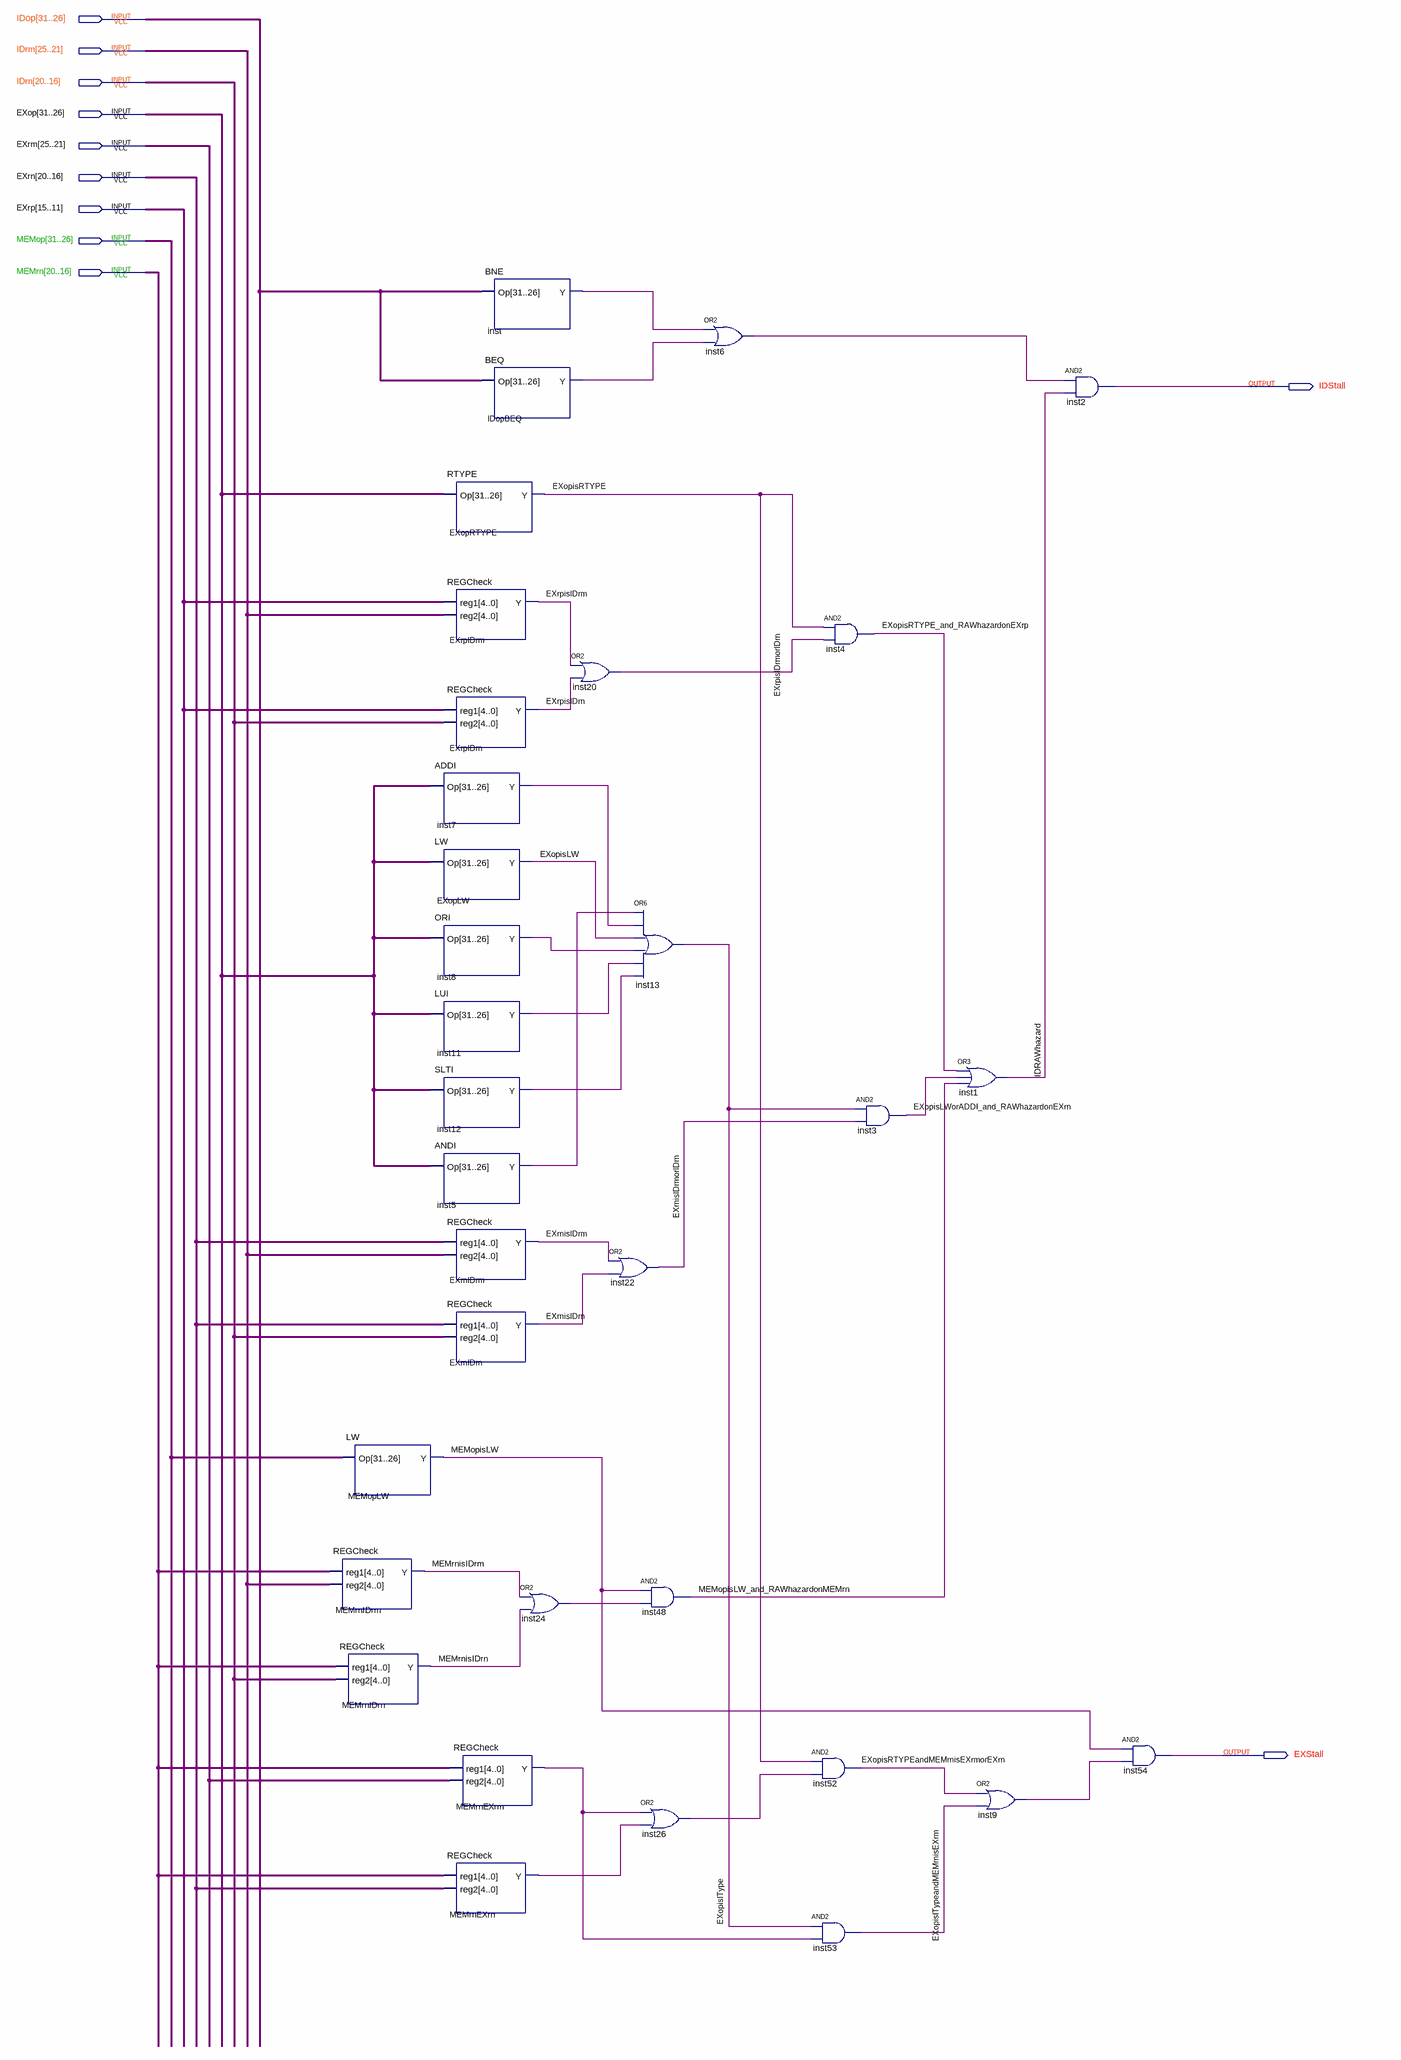
[diagram p0: schematic sheet]
// Quartus schematic StallDetection.bdf as structural Verilog: 33 symbols, 11 pins
module StallDetection (
  input  [31:26] IDop,
  input  [25:21] IDrm,
  input  [20:16] IDrn,
  input  [31:26] EXop,
  input  [25:21] EXrm,
  input  [20:16] EXrn,
  input  [15:11] EXrp,
  input  [31:26] MEMop,
  input  [20:16] MEMrn,
  output IDStall,
  output EXStall
);

  wire EXopisIType, EXopisITypeandMEMrnisEXrm, EXopisLW, EXopisLWorADDI_and_RAWhazardonEXrn, EXopisRTYPE,
       EXopisRTYPE_and_RAWhazardonEXrp, EXopisRTYPEandMEMrnisEXrmorEXrn, EXrnisIDrm, EXrnisIDrmorIDrn,
       EXrnisIDrn, EXrpisIDrm, EXrpisIDrmorIDrn, EXrpisIDrn, IDopBEQ_y, IDRAWhazard, inst5_y, inst6_out,
       inst7_y, inst8_y, inst9_out, inst11_y, inst12_y, inst24_out, inst26_out, inst_y, MEMopisLW,
       MEMopisLW_and_RAWhazardonMEMrn, MEMrnEXrm_y, MEMrnEXrn_y, MEMrnisIDrm, MEMrnisIDrn;

  LW MEMopLW (.Op(MEMop), .Y(MEMopisLW));
  REGCheck MEMrnIDrm (.reg1(MEMrn), .reg2(IDrm), .Y(MEMrnisIDrm));
  REGCheck MEMrnIDrn (.reg1(MEMrn), .reg2(IDrn), .Y(MEMrnisIDrn));
  RTYPE EXopRTYPE (.Op(EXop), .Y(EXopisRTYPE));
  REGCheck EXrpIDrm (.reg1(EXrp), .reg2(IDrm), .Y(EXrpisIDrm));
  REGCheck EXrpIDrn (.reg1(EXrp), .reg2(IDrn), .Y(EXrpisIDrn));
  ADDI inst7 (.Op(EXop), .Y(inst7_y));
  LW EXopLW (.Op(EXop), .Y(EXopisLW));
  ORI inst8 (.Op(EXop), .Y(inst8_y));
  LUI inst11 (.Op(EXop), .Y(inst11_y));
  SLTI inst12 (.Op(EXop), .Y(inst12_y));
  ANDI inst5 (.Op(EXop), .Y(inst5_y));
  REGCheck EXrnIDrm (.reg1(EXrn), .reg2(IDrm), .Y(EXrnisIDrm));
  REGCheck EXrnIDrn (.reg1(EXrn), .reg2(IDrn), .Y(EXrnisIDrn));
  REGCheck MEMrnEXrn (.reg1(MEMrn), .reg2(EXrn), .Y(MEMrnEXrn_y));
  BNE inst (.Op(IDop), .Y(inst_y));
  BEQ IDopBEQ (.Op(IDop), .Y(IDopBEQ_y));
  REGCheck MEMrnEXrm (.reg1(MEMrn), .reg2(EXrm), .Y(MEMrnEXrm_y));
  or inst24 (inst24_out, MEMrnisIDrm, MEMrnisIDrn);
  or inst20 (EXrpisIDrmorIDrn, EXrpisIDrm, EXrpisIDrn);
  or inst13 (EXopisIType, inst5_y, inst7_y, EXopisLW, inst8_y, inst11_y, inst12_y);
  or inst22 (EXrnisIDrmorIDrn, EXrnisIDrm, EXrnisIDrn);
  and inst48 (MEMopisLW_and_RAWhazardonMEMrn, MEMopisLW, inst24_out);
  or inst26 (inst26_out, MEMrnEXrm_y, MEMrnEXrn_y);
  or inst6 (inst6_out, inst_y, IDopBEQ_y);
  and inst4 (EXopisRTYPE_and_RAWhazardonEXrp, EXopisRTYPE, EXrpisIDrmorIDrn);
  and inst52 (EXopisRTYPEandMEMrnisEXrmorEXrn, EXopisRTYPE, inst26_out);
  and inst53 (EXopisITypeandMEMrnisEXrm, EXopisIType, MEMrnEXrm_y);
  and inst3 (EXopisLWorADDI_and_RAWhazardonEXrn, EXopisIType, EXrnisIDrmorIDrn);
  or inst1 (IDRAWhazard, EXopisRTYPE_and_RAWhazardonEXrp, EXopisLWorADDI_and_RAWhazardonEXrn, MEMopisLW_and_RAWhazardonMEMrn);
  or inst9 (inst9_out, EXopisRTYPEandMEMrnisEXrmorEXrn, EXopisITypeandMEMrnisEXrm);
  and inst2 (IDStall, inst6_out, IDRAWhazard);
  and inst54 (EXStall, MEMopisLW, inst9_out);
endmodule
